# EAGLE design light sensor basic (EAGLE 9.6.2)
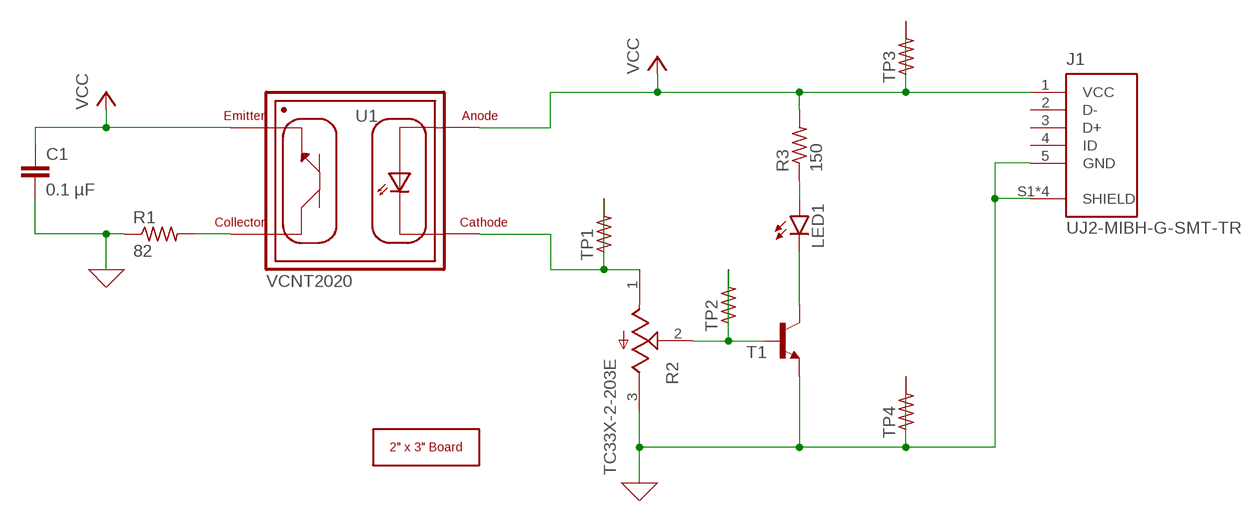
[diagram p0: schematic, sheet 1]

## Parts
C1  0.1 µF  C-EUC1206  [C1206]
J1  UJ2-MIBH-G-SMT-TR  [CUI_UJ2-MIBH-G-SMT-TR]
LED1  LEDCHIPLED_0805  [CHIPLED_0805]
R1  82  R-US_R0805  [R0805]
R2  TC33X-2-203E  [TRIM_TC33X-2-203E]
R3  150  R-US_R0805  [R0805]
T1  BFS17-NPN-SOT23-BEC  [SOT23-BEC]
TP1  R-US_R1206  [R1206]
TP2  R-US_R1206  [R1206]
TP3  R-US_R1206  [R1206]
TP4  R-US_R1206  [R1206]
U1  VCNT2020  [XDCR_VCNT2020]
U$1  2X3_BOARD_V2  [2X3_BOARD_V2]

## Nets
0: C1.2 J1.5(GND) J1.S1(SHIELD) J1.S2(SHIELD) J1.S3(SHIELD) J1.S4(SHIELD) R1.1 R2.3(CW) T1.E TP4.1 TP4.2 ; supply symbol labelled GND
N$1: R2.2(W) T1.B TP2.1 TP2.2
N$2: R1.2 U1.2(COLLECTOR)
N$3: LED1.C T1.C
N$5: R2.1(CCW) TP1.1 TP1.2 U1.4(CATHODE)
N$8: LED1.A R3.1
VCC: C1.1 J1.1(VCC) R3.2 TP3.1 TP3.2 U1.1(EMITTER) U1.3(ANODE)
Unconnected: J1.2(D-) J1.3(D+) J1.4(ID)

## Library data of the parts
C1 = rcl:C-EU: CAPACITOR, European symbol; SPICEPREFIX: C
J1 = UJ2-MIBH-G-SMT-TR:UJ2-MIBH-G-SMT-TR: USB micro B type receptacle; MANUFACTURER: CUI; MAXIMUM_PACKAGE_HEIGHT: 2.95 mm; PARTREV: 1.0; STANDARD: Manufacturer Recommendations
LED1 = led:LED: LED OSRAM: - CHIPLED LG R971, LG N971, LY N971, LG Q971, LY Q971, LO R971, LY R971 LH N974, LH R974 LS Q976, LO Q976, LY Q976 LO Q996 - Hyper CHIPLED LW Q18S LB Q993, LB Q99A, LB R99A - SideLED LS A670, LO A670, LY A670, LG A670, LP A670 LB A673, LV A673, LT A673, LW A673 LH A674 LY A675 LS A676, LA A676, LO A676, LY A676, LW A676 LS A679, LY A679, LG A679 - Hyper Micro SIDELED® LS Y876, LA Y876, LO Y876, LY Y876 LT Y87S - SmartLED LW L88C, LW L88S LB L89C, LB L89S, LG L890 LS L89K, LO L89K, LY L89K LS L896, LA L896, LO L896, LY L896 - TOPLED LS T670, LO T670, LY T670, LG T670, LP T670 LSG T670, LSP T670, LSY T670, LOP T670, LYG T670 LG T671, LOG T671, LSG T671 LB T673, LV T673, LT T673, LW T673 LH T674 LS T676, LA T676, LO T676, LY T676, LB T676, LH T676, LSB T676, LW T676 LB T67C, LV T67C, LT T67C, LS T67K, LO T67K, LY T67K, LW E67C LS E67B, LA E67B, LO E67B, LY E67B, LB E67C, LV E67C, LT E67C LW T67C LS T679, LY T679, LG T679 LS T770, LO T770, LY T770, LG T770, LP T770 LB T773, LV T773, LT T773, LW T773 LH T774 LS E675, LA E675, LY E675, LS T675 LS T776, LA T776, LO T776, LY T776, LB T776 LHGB T686 LT T68C, LB T68C - Hyper Mini TOPLED® LB M676 - Mini TOPLED Santana® LG M470 LS M47K, LO M47K, LY M47K Source: http://www.osram.convergy.de LUXEON: - LUMILED® LXK2-PW12-R00, LXK2-PW12-S00, LXK2-PW14-U00, LXK2-PW14-V00 LXK2-PM12-R00, LXK2-PM12-S00, LXK2-PM14-U00 LXK2-PE12-Q00, LXK2-PE12-R00, LXK2-PE12-S00, LXK2-PE14-T00, LXK2-PE14-U00 LXK2-PB12-K00, LXK2-PB12-L00, LXK2-PB12-M00, LXK2-PB14-N00, LXK2-PB14-P00, LXK2-PB14-Q00 LXK2-PR12-L00, LXK2-PR12-M00, LXK2-PR14-Q00, LXK2-PR14-R00 LXK2-PD12-Q00, LXK2-PD12-R00, LXK2-PD12-S00 LXK2-PH12-R00, LXK2-PH12-S00 LXK2-PL12-P00, LXK2-PL12-Q00, LXK2-PL12-R00 Source: www.luxeon.com KINGBRIGHT: KA-3528ASYC Source: www.kingbright.com
R1 R3 TP1-TP4 = rcl:R-US_: RESISTOR, American symbol; SPICEPREFIX: R
R2 = TC33X-2-203E:TC33X-2-203E: Res Trimmer 100K Ohm 25% 1/10W 1(Elec)/1(Mech)Turn (3 X 3.8mm) Foot Print SMD Embossed T/R; CHECK_PRICES: https://www.snapeda.com/parts/TC33X-2-203E/Bourns/view-part/?ref=eda; DESCRIPTION: TRIMMER-3MM OPEN FRAME, 20,000 OHMS | Bourns TC33X-2-203E; DIGIKEY_PART_NUMBER: TC33X-2-203ETR-ND; MF: Bourns; MP: TC33X-2-203E; PACKAGE: 1608 Bourns; SNAPEDA_LINK: https://www.snapeda.com/parts/TC33X-2-203E/Bourns/view-part/?ref=snap
T1 = transistor:*-NPN-: NPN Transistror BF959 corrected 2008.03.06
U1 = VCNT2020:VCNT2020: Reflective Sensor With Ptr Output; CHECK_PRICES: https://www.snapeda.com/parts/VCNT2020/Vishay+Semiconductor+Opto+Division/view-part/?ref=eda; DESCRIPTION: Reflective Optical Sensor 0.02 (0.5mm) 4-SMD Module; DIGIKEY_PART_NUMBER: VCNT2020TR-ND; MF: Vishay; MP: VCNT2020; PACKAGE: None; SNAPEDA_LINK: https://www.snapeda.com/parts/VCNT2020/Vishay+Semiconductor+Opto+Division/view-part/?ref=snap
U$1 = voltera_community_lib:2X3_BOARD

## Board
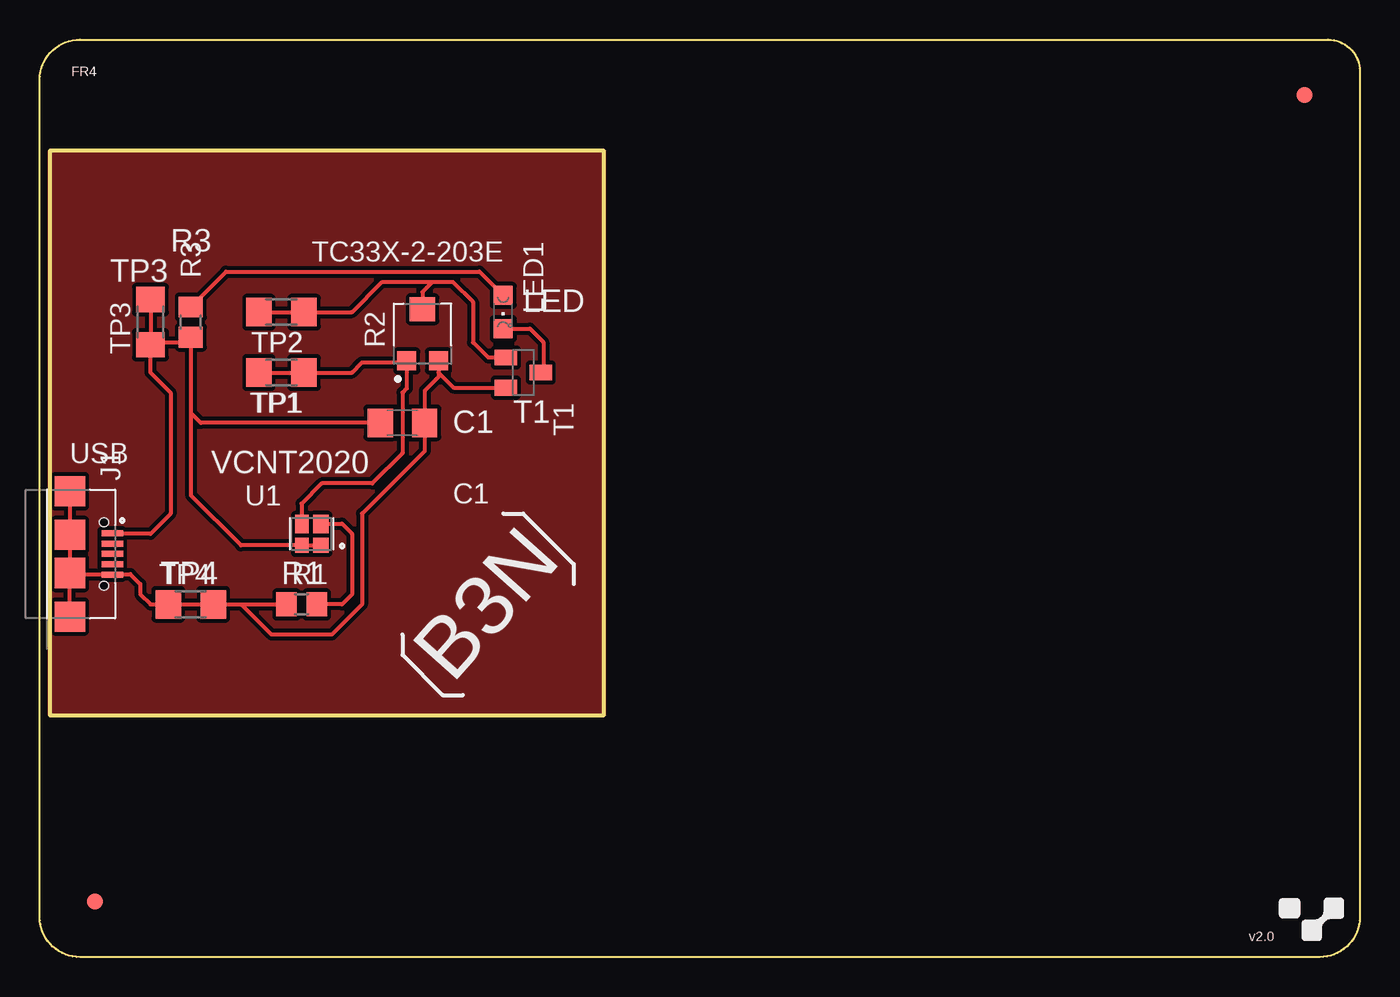
[diagram p1: board, top side]
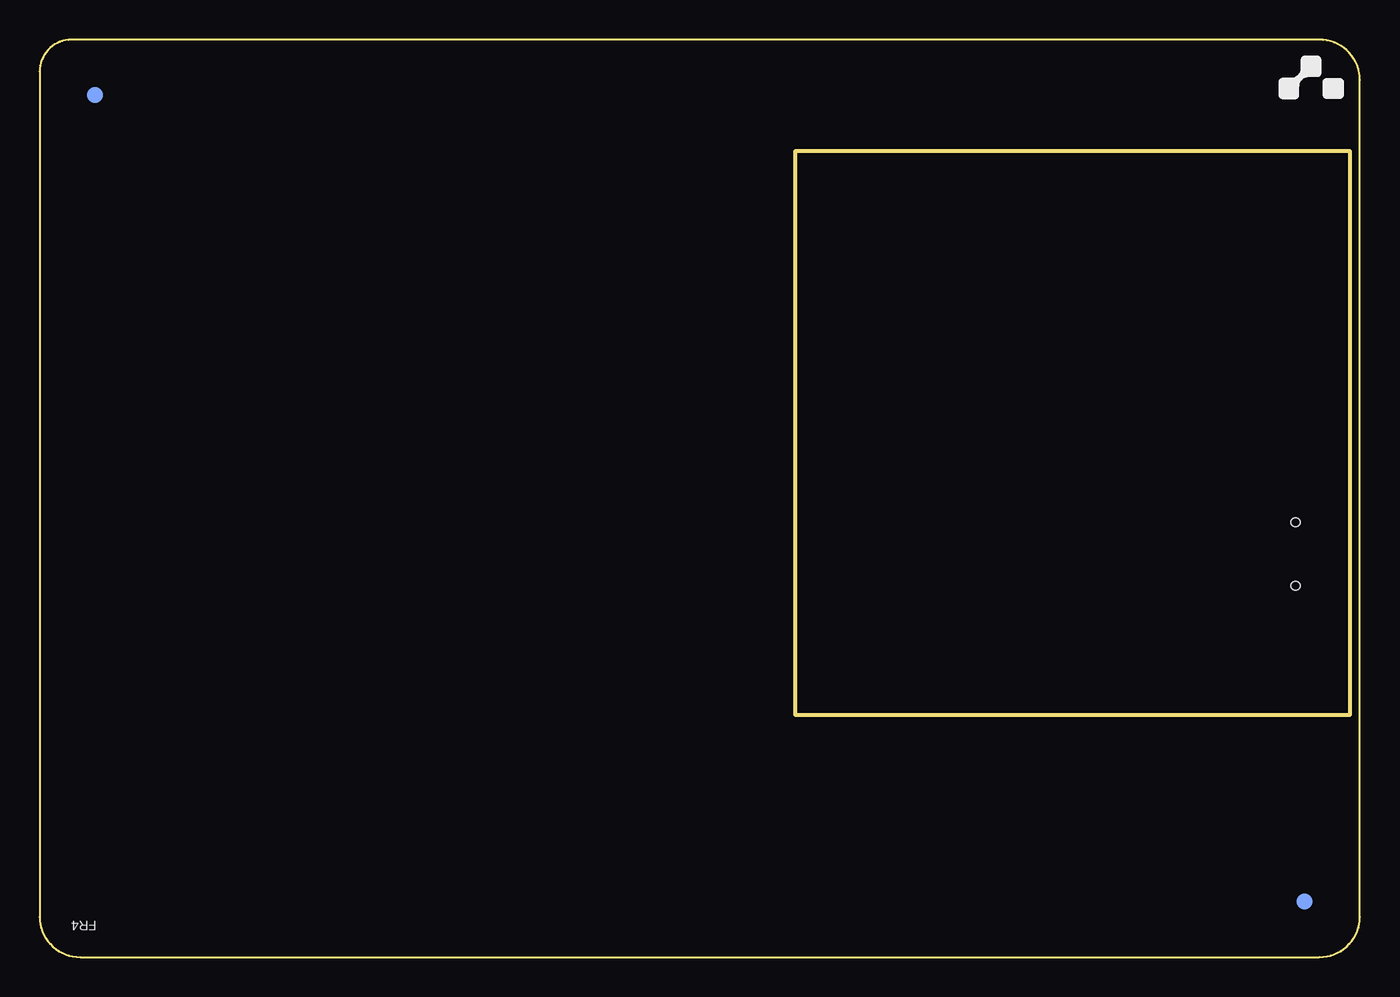
[diagram p2: board, bottom side, seen from below]

Size 34.93 x 35.56 mm. Coordinates in mm from the lower left corner, seen from the top.
Outline: 0,0 34.93,0 34.93,35.56 0,35.56 0,0
Copper layers (1*16): Top 0.035mm / dielectric 1.5mm / Bottom 0.035mm
Design rules "voltera-dru": minimum track width 10mil, minimum drill 0.4mm, track to track 10mil, track to pad 10mil, pad to pad 0.6mm, via to via 0.6mm, smd to smd 0mil, copper to edge 0mil, drill to drill 0.8mm, minimum pad ring 0.2mm, minimum via ring 0.2mm, stop-mask expansion 4mil, vias tented up to drill 0mil, thermal gap 10mil

### Footprints (pad centres in the part's own frame; a part is rotated, then mirrored left to right if it is on the bottom)
C1206 = smd 1.6 x 1.8: 1 -1.4,0; 2 1.4,0
CUI_UJ2-MIBH-G-SMT-TR = smd 0.381 x 1.346: 1 -1.3,2.675; 2 -0.65,2.675; 3 0,2.675; 4 0.65,2.675; 5 1.3,2.675 | smd 1.9 x 1.9: S1 -3.95,0; S2 -1.2,0; S3 1.2,0; S4 3.95,0 | hole 0.55: -2,2.15; 2,2.15
CHIPLED_0805 = smd 1.2 x 1.2: A 0,-1.05; C 0,1.05
R0805 = smd 1.3 x 1.5: 1 -0.95,0; 2 0.95,0
TRIM_TC33X-2-203E = smd 1.2 x 1.2: 1 -1.8,1; 3 -1.8,-1 | smd 1.5 x 1.6: 2 1.45,0
SOT23-BEC = smd 1 x 1.4: B -0.95,-1.1; C 0,1.1; E 0.95,-1.1
R1206 = smd 1.6 x 1.803: 1 -1.422,0; 2 1.422,0
XDCR_VCNT2020 = smd 0.97 x 0.95: 1 -0.57,0.725 | smd 0.97 x 1.15: 2 -0.57,-0.625 | smd 0.85 x 0.95: 3 0.63,0.725 | smd 0.85 x 1.15: 4 0.63,-0.625
2X3_BOARD_V2 = smd 1 x 1: P$1 79.7,54.3; P$3 3.5,3.5 | smd 1 x 1 bottom: P$2 79.7,54.3; P$4 3.5,3.5

### Placement (x,y rotation side)
C1  22.22,18.41 0 top
J1  1.27,10.16 270 top
LED1  28.57,25.4 180 top
R1  15.88,6.99 0 top
R2  23.49,24.13 90 top
R3  8.89,24.77 270 top
T1  29.84,21.59 270 top
TP1  14.61,21.59 180 top
TP2  14.61,25.4 0 top
TP3  6.35,24.77 270 top
TP4  8.89,6.99 0 top
U1  16.51,11.43 180 top
U$1  -0.64,-15.24 0 top

### Tracks (layer width: path | path; a pad name or v marks a point on that pad's centre or on a via)
0
  Top 0.254: 1.37,8.86 J1.5 3.98,8.89 5.08,8.89 5.71,8.26 5.71,7.62 6.35,6.99 TP4.1 TP4.2 12.06,6.99 | 1.37,8.86 J1.S3 | J1.S4 1.27,8.76 | 1.27,8.76 1.37,8.86 | 1.27,8.76 J1.S2 J1.S1 | 12.06,6.99 R1.1 | 12.06,6.99 13.97,5.08 17.78,5.08 19.68,6.99 19.68,12.7 23.62,16.64 C1.2 23.62,20.45 24.49,21.32 24.49,21.59 | R2.3 24.49,21.59 | 24.49,21.59 25.44,20.64 T1.E
GND
  pour Top (isolate 0): 0,35.56 34.93,35.56 34.93,0 0,0
N$1
  Top 0.254: TP2.1 TP2.2 19.05,25.4 20.95,27.3 24.13,27.3 | 24.13,27.3 25.4,27.3 26.67,26.03 26.67,23.49 27.62,22.54 T1.B | R2.2 23.49,26.67 24.13,27.3
N$2
  Top 0.254: U1.2 18.4,12.06 18.41,12.06 19.05,11.43 19.05,7.62 18.41,6.99 R1.2
N$3
  Top 0.254: T1.C 31.11,21.59 31.11,23.49 30.26,24.35 LED1.C
N$5
  Top 0.254: U1.4 15.88,13.33 17.14,14.6 20.32,14.6 22.22,16.51 22.22,20.32 22.49,20.59 22.49,22.23 | R2.1 22.49,22.23 | TP1.2 TP1.1 19.05,21.59 19.68,22.23 22.49,22.23
N$8
  Top 0.254: R3.1 11.12,27.94 27.08,27.94 LED1.A
VCC
  Top 0.254: TP3.2 6.35,21.59 7.62,20.32 7.62,12.7 6.35,11.43 6.32,11.46 J1.1 | TP3.1 TP3.2 | R3.2 8.89,23.49 | 8.89,23.49 8.89,19.05 | 8.89,19.05 8.89,13.87 12.05,10.71 U1.3 U1.1 | 8.89,19.05 9.53,18.41 C1.1 | TP3.2 6.5,23.49 8.89,23.49

### Text on the board
tPlace: R3 | TC33X-2-203E | TP3 | LED | TP2 | TP1 | T1 | C1 | USB | VCNT2020 | TP4 | R1 | B3N